# Altium schematic sheet USB.SchDoc
size 420 x 297 mm; SheetNumber: 3; SheetTotal: 4
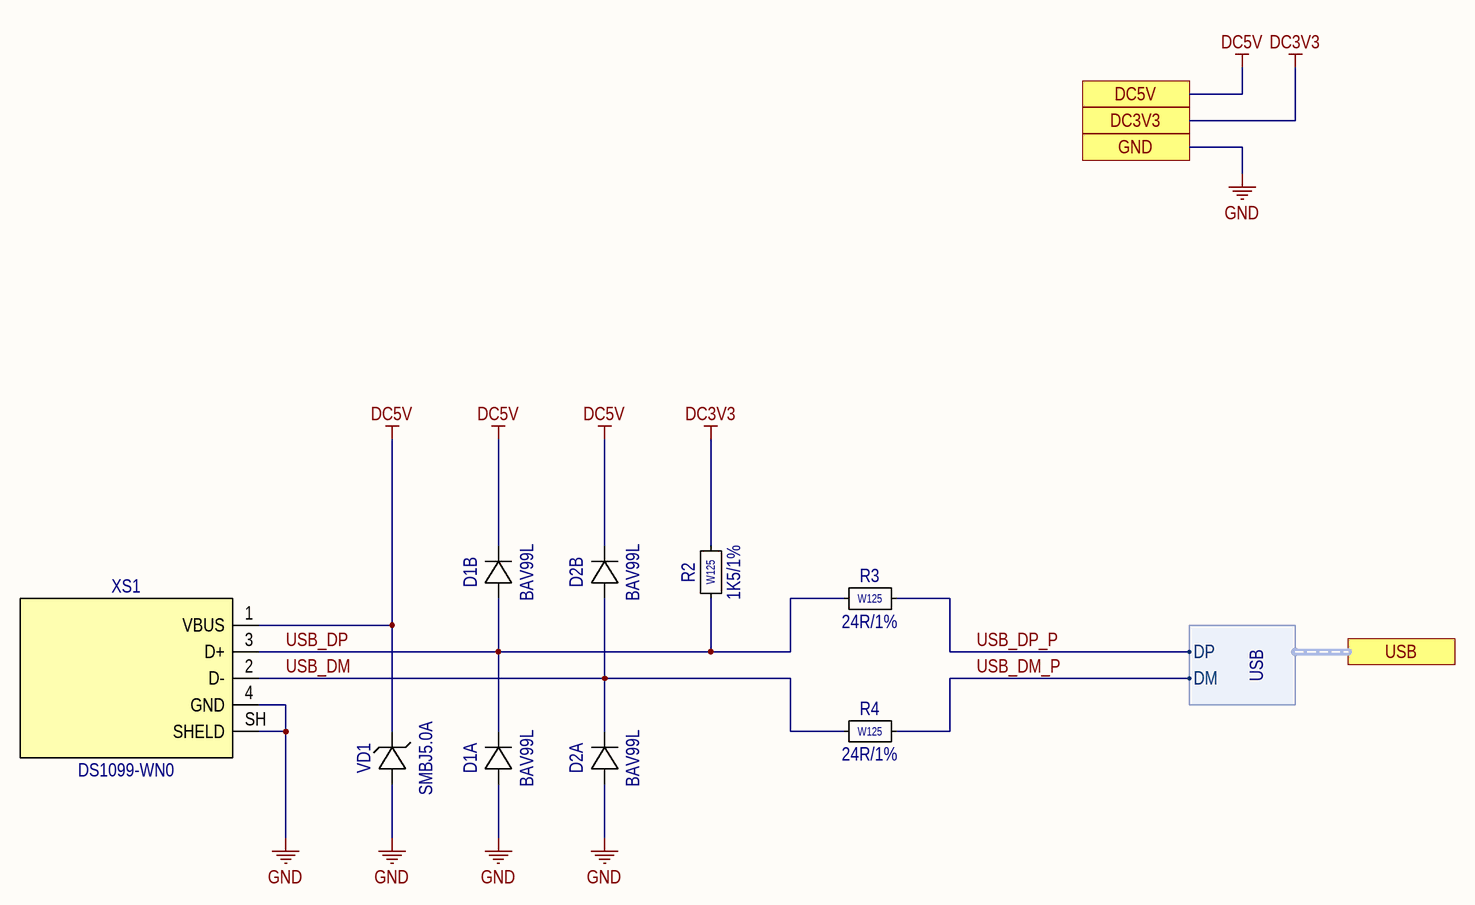
[diagram p0: USB.SchDoc]

## Parts
D1  BAV99L  [3-SOT23]  (parts A,B of 2)
D2  BAV99L  [3-SOT23]  (parts A,B of 2)
R2  value 1K5/1%  [SMD_RES_0805-L2000-W1250-H500-M1501]  (hidden comment: CR0805-1K5-1%)
R3  value 24R/1%  [SMD_RES_0805-L2000-W1250-H500-M24R0]  (hidden comment: CR0805-24R-1%)
R4  value 24R/1%  [SMD_RES_0805-L2000-W1250-H500-M24R0]  (hidden comment: CR0805-24R-1%)
VD1  SMBJ5.0A  [2-MOLDED-E4600-D4000-A2700-H5600-B2200]
XS1  DS1099-WN0  [DS1099]

## Ports
DC3V3, DC5V, GND, USB (harness USB)

## Harnesses
USB: DP, DM

## Nets
DC3V3: R2.2 ; port DC3V3
DC5V: D1.2 D2.2 VD1.1 XS1.1(VBUS) ; port DC5V
GND: D1.1 D2.1 VD1.2 XS1.4(GND) XS1.SH(SHELD) ; port GND
USB_DM: D2.3 R4.1 XS1.2(D-)
USB_DM_P: R4.2 ; port USB.DM
USB_DP: D1.3 R2.1 R3.1 XS1.3(D+)
USB_DP_P: R3.2 ; port USB.DP

## Notes on the sheet
- Подп. и дата
- Инв. № дубл.
- Взам. инв. №
- Инв № подл.
- Изм.
- Лист
- № докум.
- Подп.
- Дата
- Стр.
- Формат А3
- (in symbol CR0805-1K5-1%) W125
- (in symbol CR0805-24R-1%) W125

## Library data of the parts
D1 D2 = BAV99L: Single high-speed switching diodes, fabricated in planar technology, and encapsulated in small hermetically sealed glass SOD80C Surface-Mounted Device (SMD) packages.
R2 = CR0805-1K5-1%: Film resistor SMD 0805
R3 R4 = CR0805-24R-1%: Film resistor SMD 0805
VD1 = SMBJ5.0A: Single high-speed switching diodes, fabricated in planar technology, and encapsulated in small hermetically sealed glass SOD80C Surface-Mounted Device (SMD) packages.
XS1 = DS1099-WN0: USB Type-B R/A DIP Type Connector; Manufacturer: Connfly Electronic Co. Ltd